# Altium schematic sheet ETH_PART.SchDoc
size A4; SheetTotal: 8
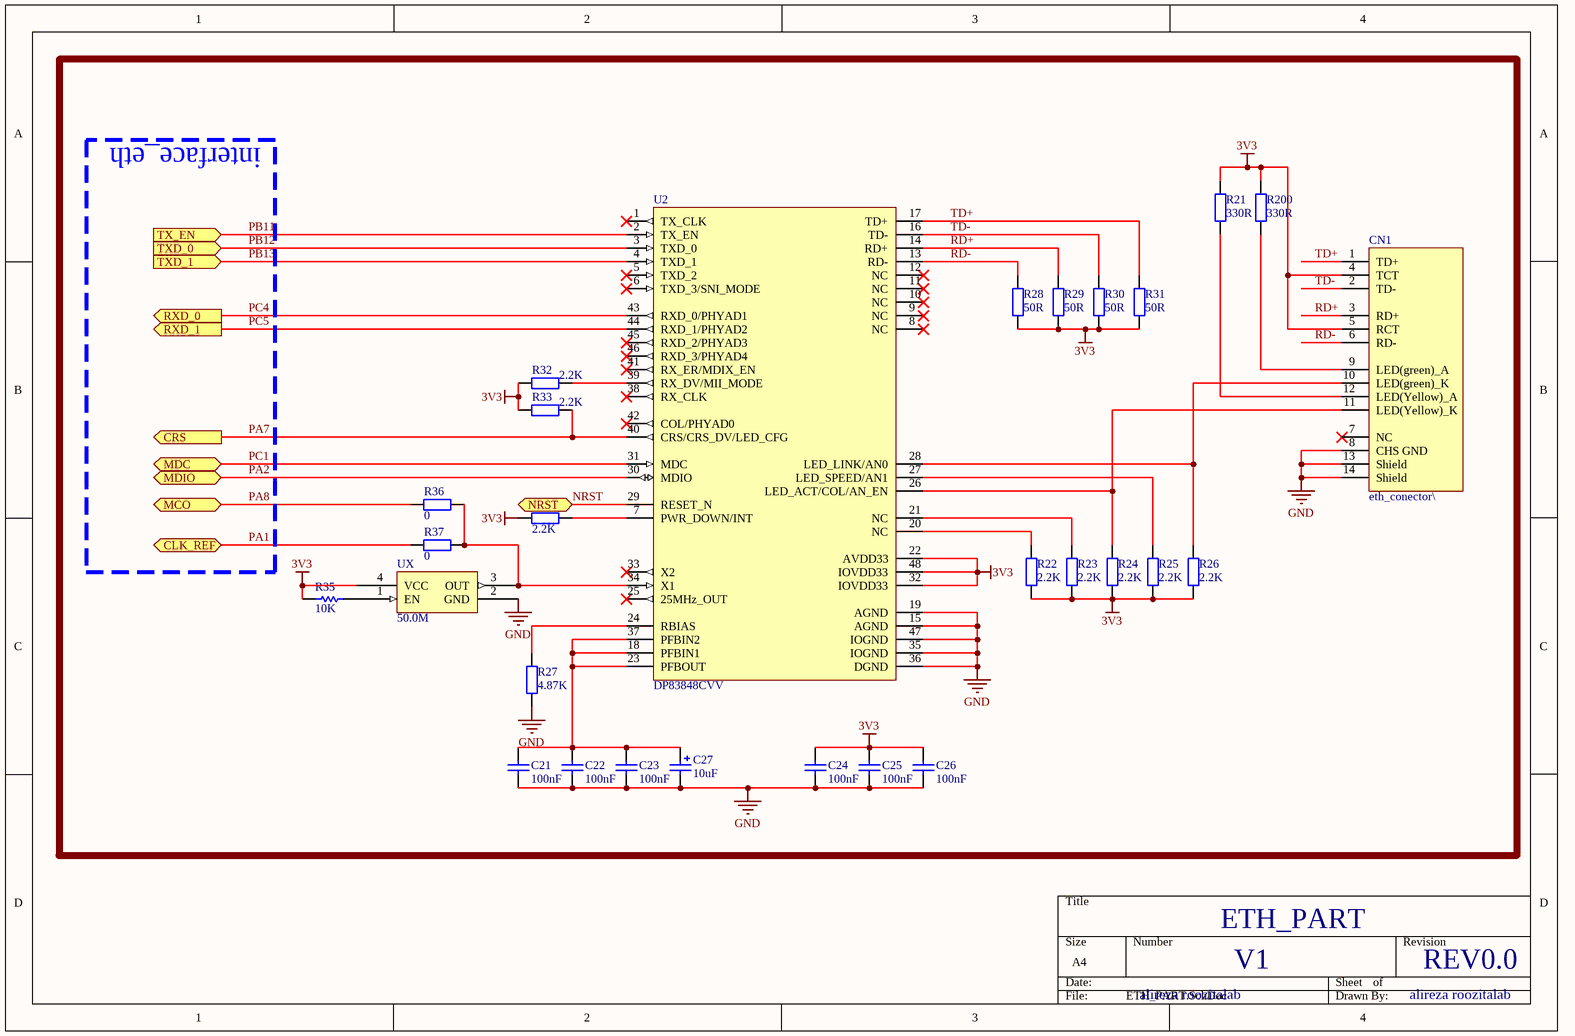
[diagram p0: ETH_PART.SchDoc]

## Parts
C21  100nF  [0805.]
C22  100nF  [0805.]
C23  100nF  [0805.]
C24  100nF  [0805.]
C25  100nF  [0805.]
C26  100nF  [0805.]
C27  10uF  [C1206.]
CN1  eth_conector\  [eth_conector]
R21  value 330R  [0805.]  (hidden comment: Res2)
R22  value 2.2K  [0805.]  (hidden comment: Res2)
R23  value 2.2K  [0805.]  (hidden comment: Res2)
R24  value 2.2K  [0805.]  (hidden comment: Res2)
R25  value 2.2K  [0805.]  (hidden comment: Res2)
R26  value 2.2K  [0805.]  (hidden comment: Res2)
R27  value 4.87K  [0805.]  (hidden comment: Res2)
R28  value 50R  [0805.]  (hidden comment: Res2)
R29  value 50R  [0805.]  (hidden comment: Res2)
R30  value 50R  [0805.]  (hidden comment: Res2)
R31  value 50R  [0805.]  (hidden comment: Res2)
R32  value 2.2K  [0805.]  (hidden comment: Res2)
R33  value 2.2K  [0805.]  (hidden comment: Res2)
R34  value 2.2K  [0805.]  (hidden comment: Res2)
R35  10K  [0805.]
R36  value 0  [0805.]  (hidden comment: Res2)
R37  value 0  [0805.]  (hidden comment: Res2)
R200  value 330R  [0805.]  (hidden comment: Res2)
U2  DP83848CVV  [LQFP48]
UX  50.0M  [oscillator_50MHZ]

## Blocks framed on the sheet
interface_eth: C21-C27 CN1 R21-R37 R200 U2 UX

## Ports
CLK_REF (bidir), CRS (out), MCO (bidir), MDC (bidir), MDIO (bidir), NRST (bidir), RXD_0 (out), RXD_1 (out), TX_EN (in), TXD_0 (in), TXD_1 (in)

## Nets
3V3: C24.1 C25.1 C26.1 CN1.4(TCT) CN1.5(RCT) R21.2 R22.1 R23.1 R24.1 R25.1 R26.1 R28.1 R29.1 R30.1 R31.1 R32.1 R33.1 R34.1 R35.1 R200.2 U2.22(AVDD33) U2.32(IOVDD33) U2.48(IOVDD33) UX.4(VCC)
GND: C21.2 C22.2 C23.2 C24.2 C25.2 C26.2 C27.2 CN1.8(CHS_GND) CN1.13(Shield) CN1.14(Shield) R27.1 U2.15(AGND) U2.19(AGND) U2.35(IOGND) U2.36(DGND) U2.47(IOGND) UX.2(GND)
NRST: U2.29(RESET_N) ; port NRST
PA1: R37.1 ; port CLK_REF
PA2: U2.30(MDIO) ; port MDIO
PA7: R33.2 U2.40(CRS/CRS_DV/LED_CFG) ; port CRS
PA8: R36.1 ; port MCO
PB11: U2.2(TX_EN) ; port TX_EN
PB12: U2.3(TXD_0) ; port TXD_0
PB13: U2.4(TXD_1) ; port TXD_1
PC1: U2.31(MDC) ; port MDC
PC4: U2.43(RXD_0/PHYAD1) ; port RXD_0
PC5: U2.44(RXD_1/PHYAD2) ; port RXD_1
RD+: CN1.3(RD+) R29.2 U2.14(RD+)
RD-: CN1.6(RD-) R28.2 U2.13(RD-)
TD+: CN1.1(TD+) R31.2 U2.17(TD+)
TD-: CN1.2(TD-) R30.2 U2.16(TD-)
NetC21_1: C21.1 C22.1 C23.1 C27.1 U2.18(PFBIN1) U2.23(PFBOUT) U2.37(PFBIN2)
NetCN1_9: CN1.9(LED(green)_A) R200.1
NetCN1_10: CN1.10(LED(green)_K) R26.2 U2.28(LED_LINK/AN0)
NetCN1_11: CN1.11(LED(Yellow)_K) R24.2 U2.26(LED_ACT/COL/AN_EN)
NetCN1_12: CN1.12(LED(Yellow)_A) R21.1
NetR22_2: R22.2 U2.20(NC)
NetR23_2: R23.2 U2.21(NC)
NetR25_2: R25.2 U2.27(LED_SPEED/AN1)
NetR27_2: R27.2 U2.24(RBIAS)
NetR32_2: R32.2 U2.39(RX_DV/MII_MODE)
NetR34_2: R34.2 U2.7(PWR_DOWN/INT)
NetR35_2: R35.2 UX.1(EN)
NetR36_2: R36.2 R37.2 U2.34(X1) UX.3(OUT)

Not connected (* = marked no-connect by the designer): CN1 7(NC)*; U2 1(TX_CLK)* 5(TXD_2)* 6(TXD_3/SNI_MODE)* 8(NC)* 9(NC)* 10(NC)* 11(NC)* 12(NC)* 25(25MHz_OUT)* 33(X2)* 38(RX_CLK)* 41(RX_ER/MDIX_EN)* 42(COL/PHYAD0)* 45(RXD_2/PHYAD3)* 46(RXD_3/PHYAD4)*

## Notes on the sheet
- ETH_PART
- V1
- REV0.0
- alireza roozitalab

## Library data of the parts
C21-C26 = Cap: Capacitor; Published: 8-Jun-2000; LatestRevisionDate: 17-Jul-2002; LatestRevisionNote: Re-released for DXP Platform.; PackageReference: RAD-0.3; Publisher: Altium Limited; PackageDescription: Radial Cap, Thru-Hole; 2 Leads; 0.3 in Pin Spacing; Value: 100nF
C27 = Cap Pol1: Polarized Capacitor (Radial); Published: 8-Jun-2000; Revision: July-2002: Re-released for DXP Platform.; Publisher: Altium Limited; Value: 10uF
R21-R34 R36 R37 R200 = Res2: Resistor; Published: 8-Jun-2000; LatestRevisionDate: 17-Jul-2002; LatestRevisionNote: Re-released for DXP Platform.; PackageReference: AXIAL-0.4; Publisher: Altium Limited; PackageDescription: Axial Device, Thru-Hole; 2 Leads; 0.4 in Pin Spacing
R35 = Res1: Resistor; Value: 1K; Published: 8-Jun-2000; Revision: July-2002: Re-released for DXP Platform.; Publisher: Altium Limited
UX = SM7745HEV-50.0M